# Altium schematic sheet 100-677-01-00 BCB.SchDoc: Battery Control Board (part 1 of 3)
size 889 x 508 mm; DrawnBy: LS/RK; DocumentNumber: 100-677-01-00; Revision: 01-00; SheetNumber: 1; SheetTotal: 1; PageSetup: Record=PageOptions|CenterHorizontal=True|CenterVertical=True|PrintScale=0.21|XCorrection=1.00|YCorrection=1.00|PrintKind=0|BorderSize=5000000|LeftOffset=0|BottomOffset=0|Orientation=2|PaperLength=1000|PaperWidth=1000|Scale=100|PaperSource=7|PrintQuality=-4|MediaType=1|DitherType=10|PaperKind=11x17|PrintScaleMode=1
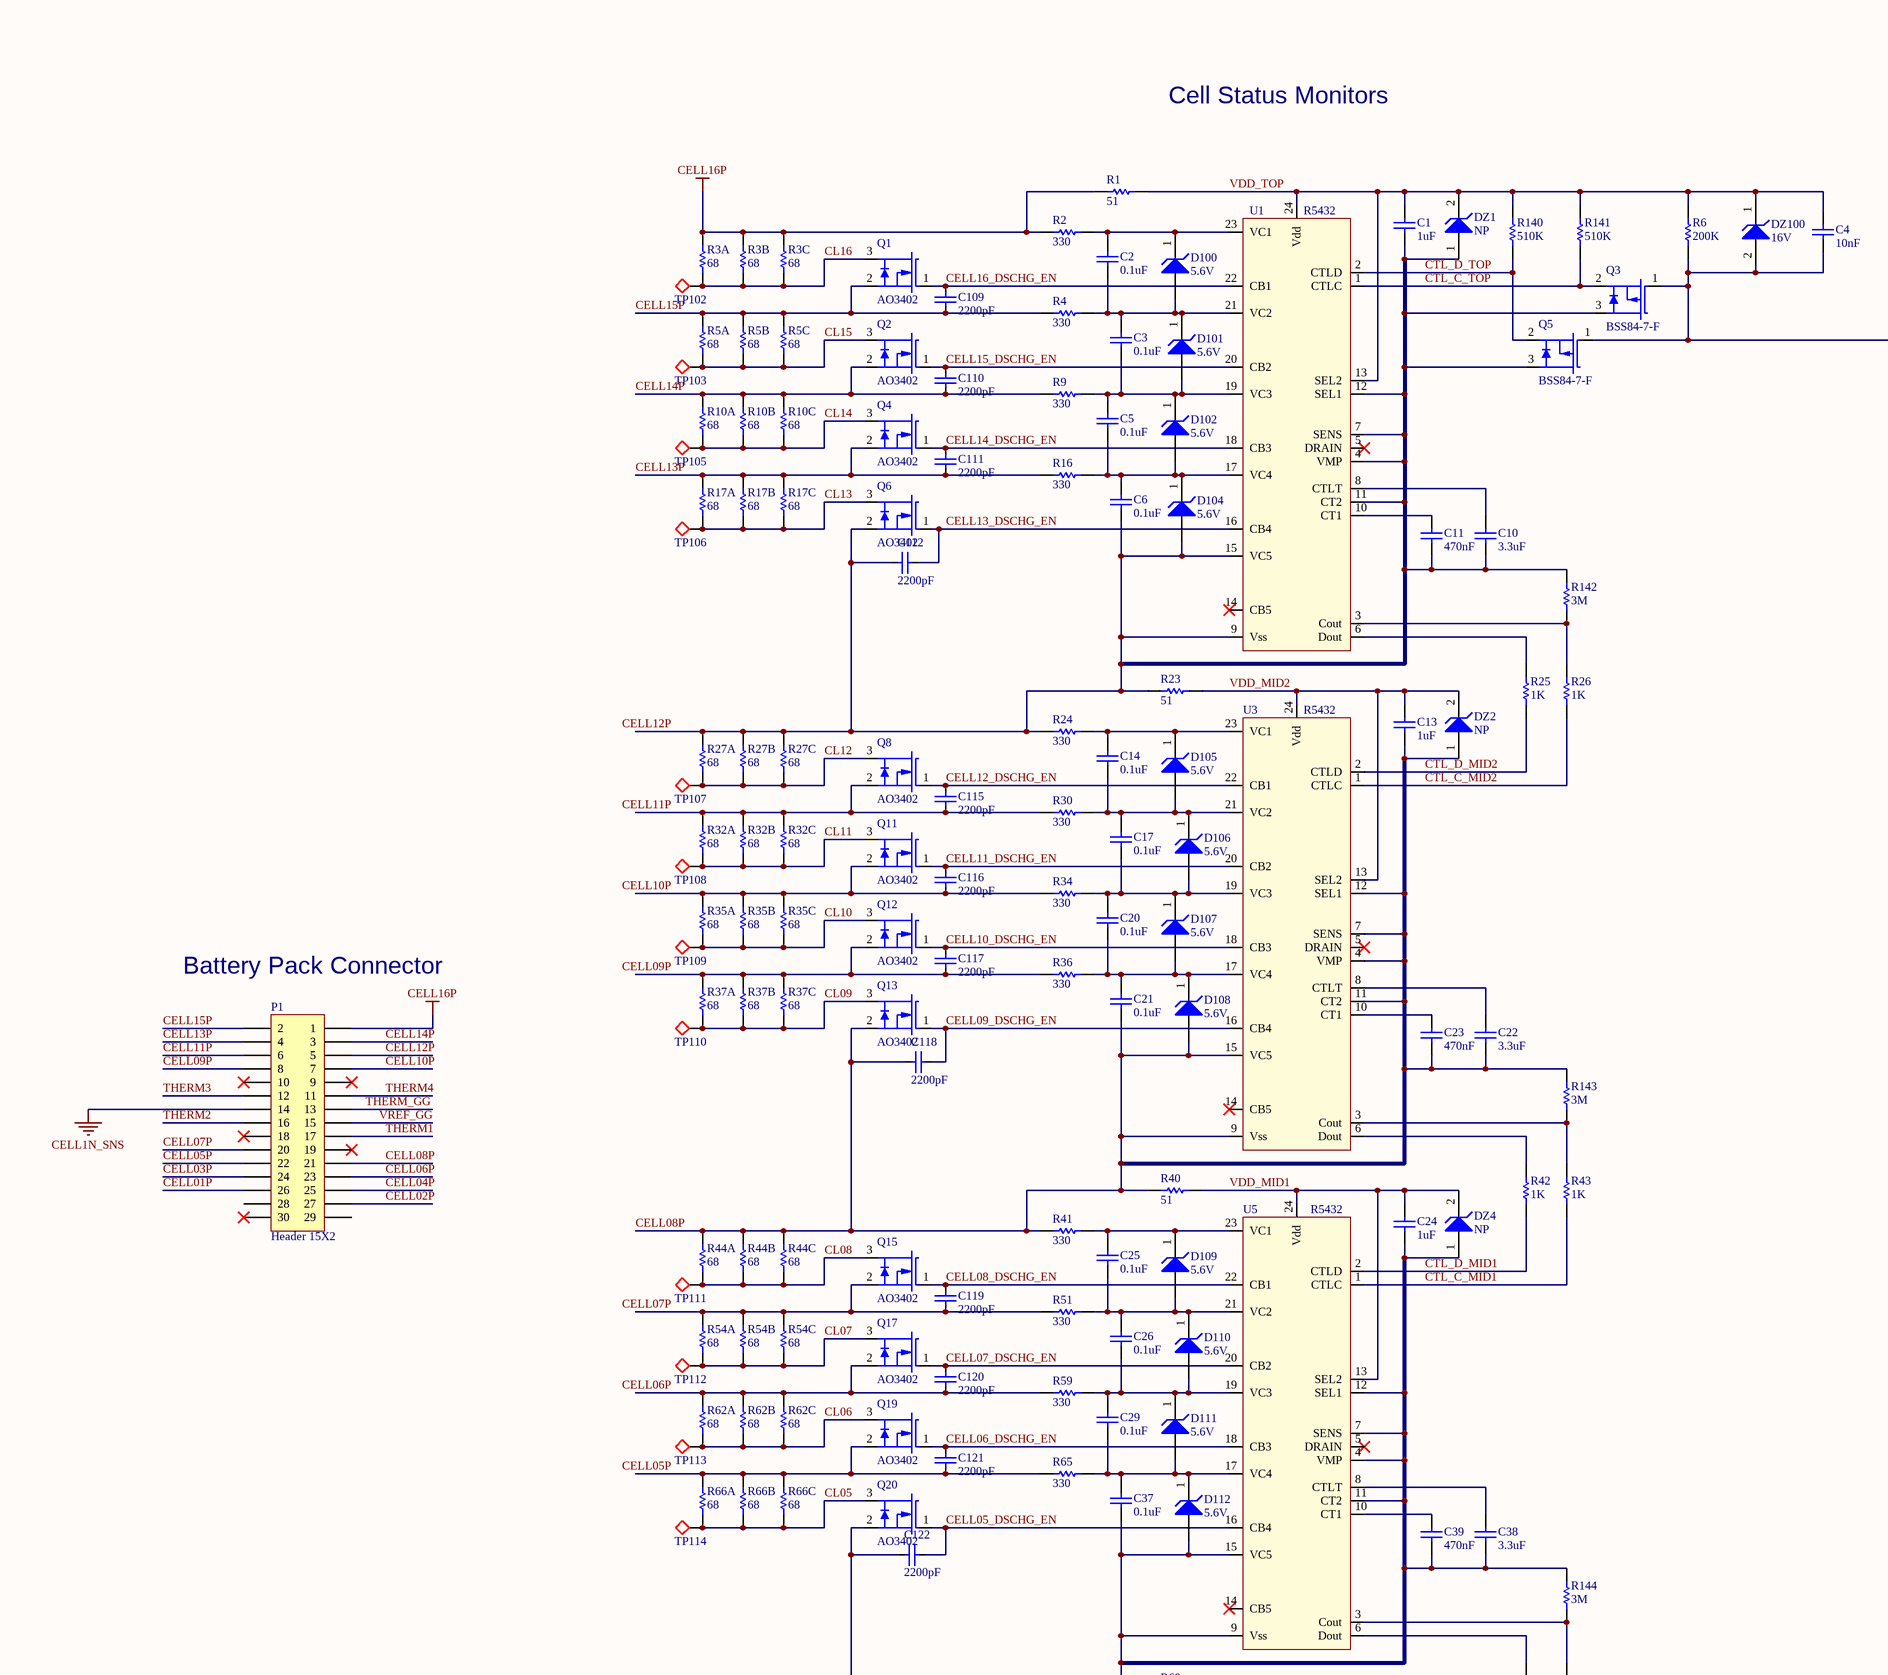
[diagram p0: 100-677-01-00 BCB.SchDoc, top left]
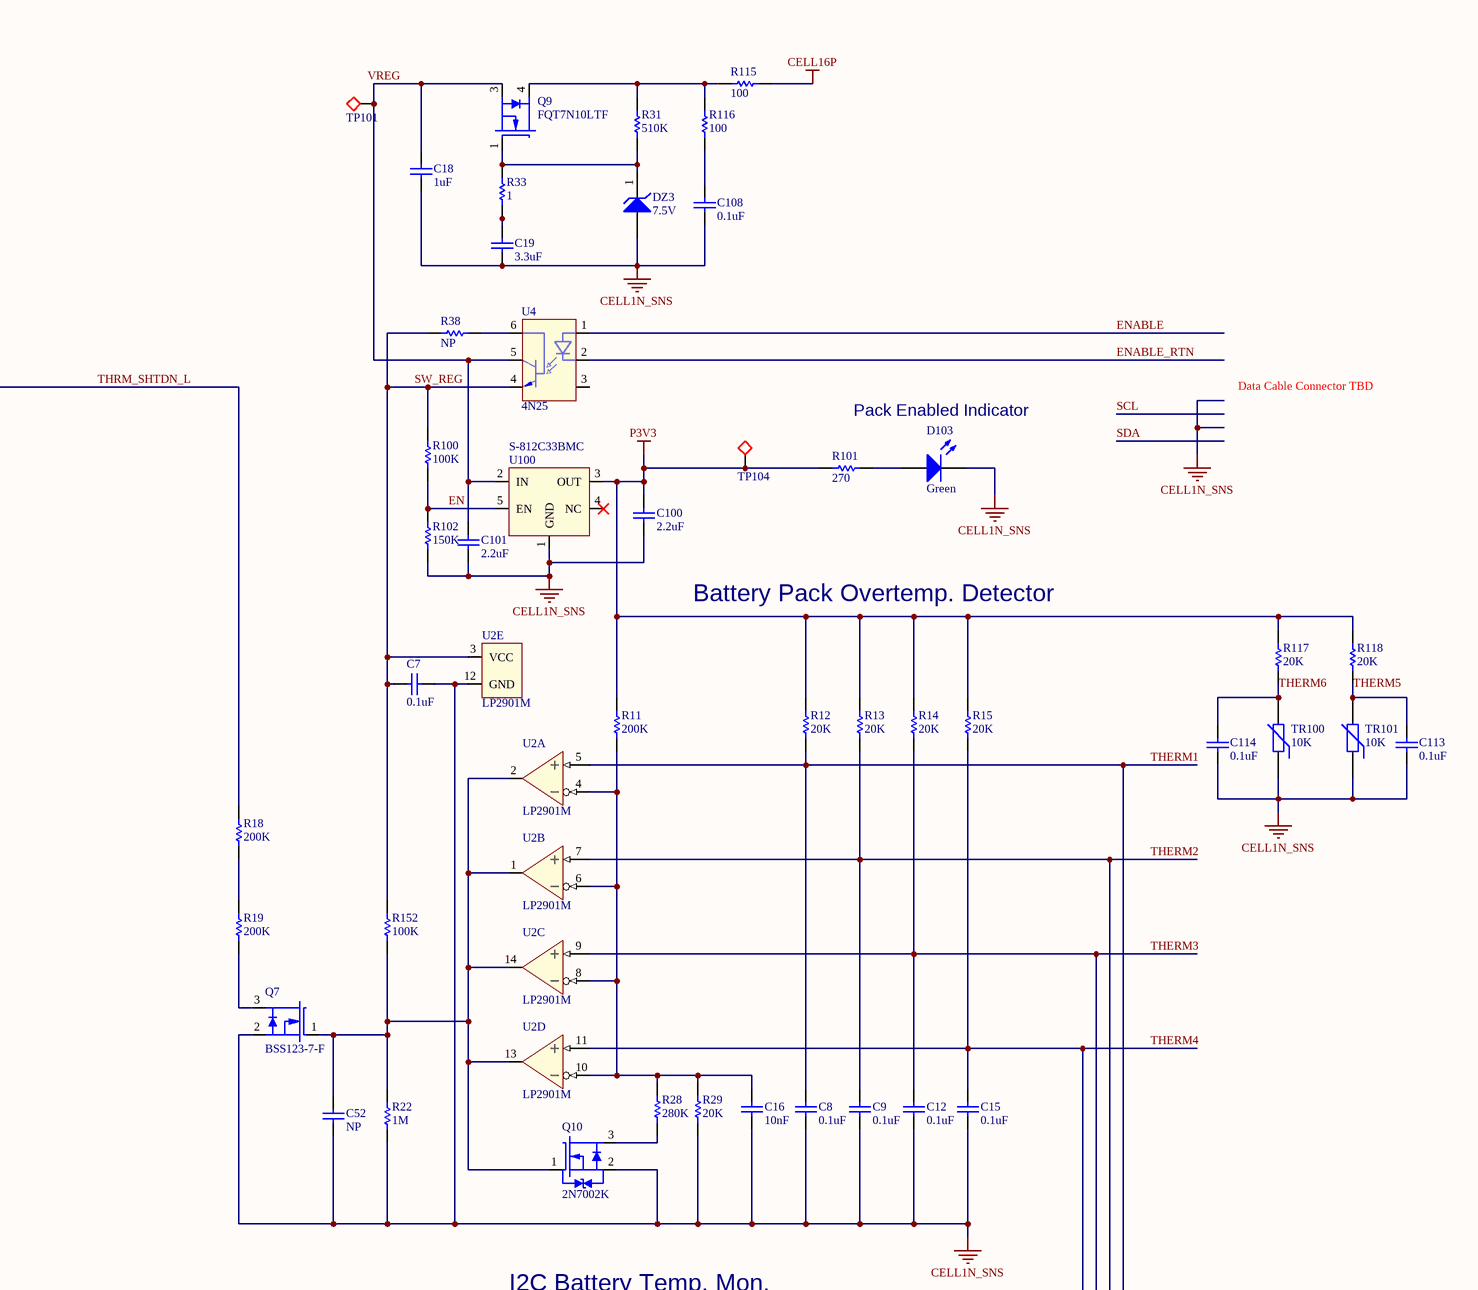
[diagram p1: 100-677-01-00 BCB.SchDoc, top middle]
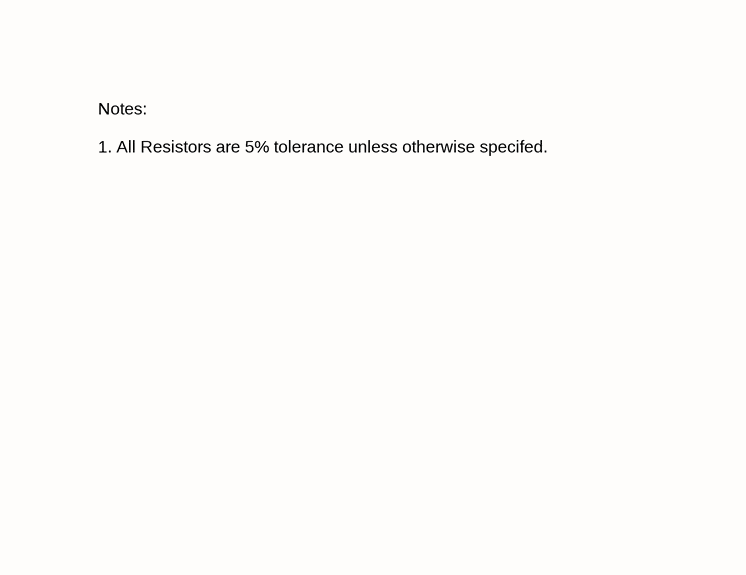
[diagram p2: 100-677-01-00 BCB.SchDoc, top right]
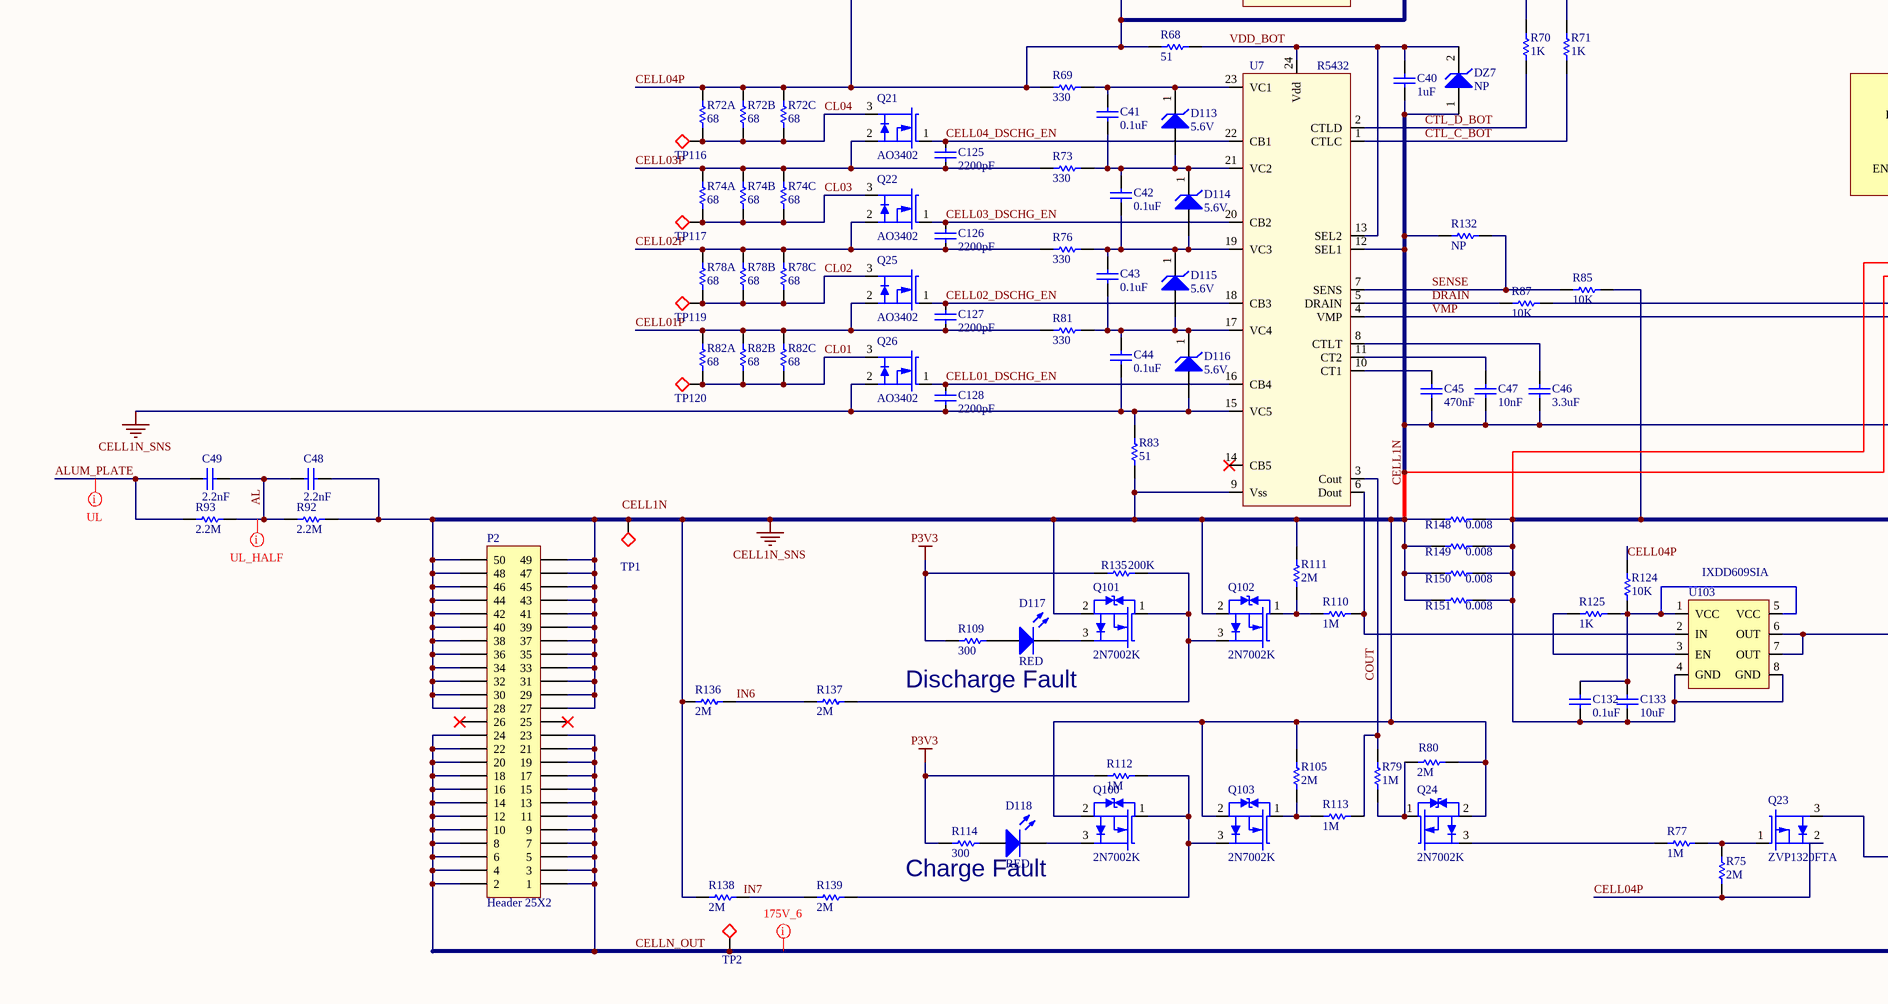
[diagram p3: 100-677-01-00 BCB.SchDoc, bottom left]
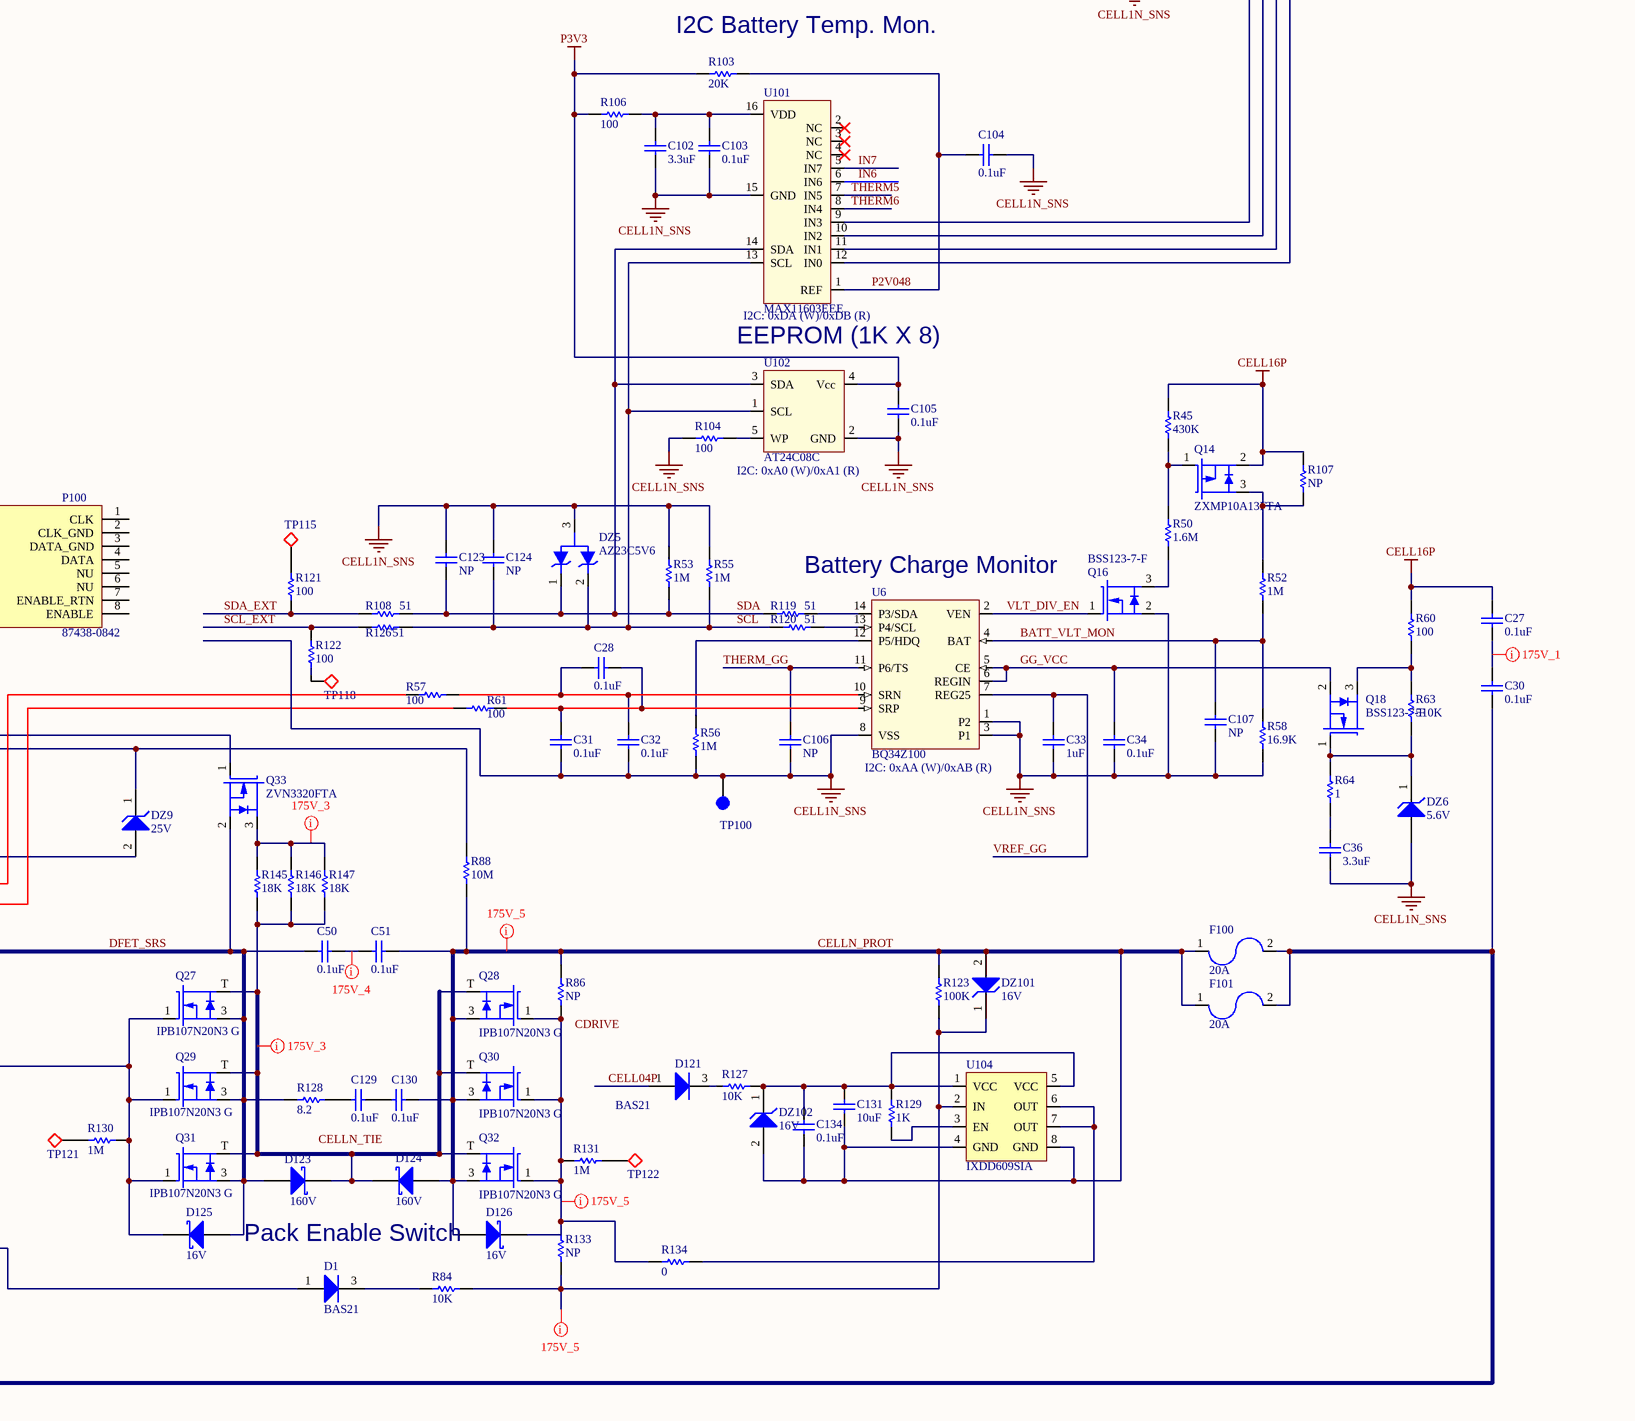
[diagram p4: 100-677-01-00 BCB.SchDoc, bottom middle]
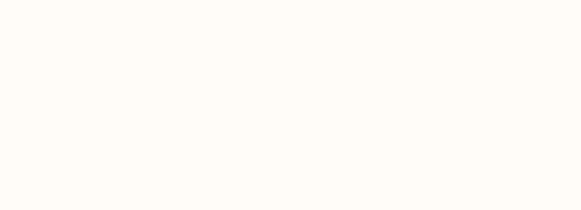
[diagram p5: 100-677-01-00 BCB.SchDoc, bottom right]

## Parts
C1  1uF  [6-0805_N]
C2  0.1uF  [1608[0603]]
C3  0.1uF  [1608[0603]]
C4  10nF  [1608[0603]]
C5  0.1uF  [1608[0603]]
C6  0.1uF  [1608[0603]]
C7  0.1uF  [1608[0603]]
C8  0.1uF  [1608[0603]]
C9  0.1uF  [1608[0603]]
C10  3.3uF  [6-0805_M]
C11  470nF  [1608[0603]]
C12  0.1uF  [1608[0603]]
C13  1uF  [6-0805_N]
C14  0.1uF  [1608[0603]]
C15  0.1uF  [1608[0603]]
C16  10nF  [1608[0603]]
C17  0.1uF  [1608[0603]]
C18  1uF  [1608[0603]]
C19  3.3uF  [6-0805_M]
C20  0.1uF  [1608[0603]]
C21  0.1uF  [1608[0603]]
C22  3.3uF  [6-0805_M]
C23  470nF  [1608[0603]]
C24  1uF  [6-0805_N]
C25  0.1uF  [1608[0603]]
C26  0.1uF  [1608[0603]]
C27  0.1uF  [C1206]
C28  0.1uF  [1608[0603]]
C29  0.1uF  [1608[0603]]
C30  0.1uF  [C1206]
C31  0.1uF  [1608[0603]]
C32  0.1uF  [1608[0603]]
C33  1uF  [6-0805_N]
C34  0.1uF  [1608[0603]]
C36  3.3uF  [6-0805_M]
C37  0.1uF  [1608[0603]]
C38  3.3uF  [6-0805_M]
C39  470nF  [1608[0603]]
C40  1uF  [6-0805_N]
C41  0.1uF  [1608[0603]]
C42  0.1uF  [1608[0603]]
C43  0.1uF  [1608[0603]]
C44  0.1uF  [1608[0603]]
C45  470nF  [1608[0603]]
C46  3.3uF  [6-0805_M]
C47  10nF  [1608[0603]]
C48  2.2nF  [1812]
C49  2.2nF  [1812]
C50  0.1uF  [C1206]
C51  0.1uF  [C1206]
C52  NP  [1608[0603]]
C100  2.2uF  [6-0805_M]
C101  2.2uF  [6-0805_M]
C102  3.3uF  [6-0805_M]
C103  0.1uF  [1608[0603]]
C104  0.1uF  [1608[0603]]
C105  0.1uF  [1608[0603]]
C106  NP  [1608[0603]]
C107  NP  [1608[0603]]
C108  0.1uF  [1608[0603]]
C109  2200pF  [1608[0603]]
C110  2200pF  [1608[0603]]
C111  2200pF  [1608[0603]]
C112  2200pF  [1608[0603]]
C113  0.1uF  [1608[0603]]
C114  0.1uF  [1608[0603]]
C115  2200pF  [1608[0603]]
C116  2200pF  [1608[0603]]
C117  2200pF  [1608[0603]]
C118  2200pF  [1608[0603]]
C119  2200pF  [1608[0603]]
C120  2200pF  [1608[0603]]
C121  2200pF  [1608[0603]]
C122  2200pF  [1608[0603]]
C123  NP  [1608[0603]]
C124  NP  [1608[0603]]
C125  2200pF  [1608[0603]]
C126  2200pF  [1608[0603]]
C127  2200pF  [1608[0603]]
C128  2200pF  [1608[0603]]
C129  0.1uF  [C1206]
C130  0.1uF  [C1206]
C131  10uF  [C1206]
C132  0.1uF  [1608[0603]]
C133  10uF  [C1206]
C134  0.1uF  [1608[0603]]
D1  BAS21  [SOT23_N]
D100  5.6V  [BZT52H (SOD123F)]
D101  5.6V  [BZT52H (SOD123F)]
D102  5.6V  [BZT52H (SOD123F)]
D103  Green  [LED SM REVERSE-GRN]
D104  5.6V  [BZT52H (SOD123F)]
D105  5.6V  [BZT52H (SOD123F)]
D106  5.6V  [BZT52H (SOD123F)]
D107  5.6V  [BZT52H (SOD123F)]
D108  5.6V  [BZT52H (SOD123F)]
D109  5.6V  [BZT52H (SOD123F)]
D110  5.6V  [BZT52H (SOD123F)]
D111  5.6V  [BZT52H (SOD123F)]
D112  5.6V  [BZT52H (SOD123F)]
D113  5.6V  [BZT52H (SOD123F)]
D114  5.6V  [BZT52H (SOD123F)]
D115  5.6V  [BZT52H (SOD123F)]
D116  5.6V  [BZT52H (SOD123F)]
D117  RED  [LED SM REVERSE-RED]
D118  RED  [LED SM REVERSE-RED]
D121  BAS21  [SOT23_N]
D123  160V  [SMB]
D124  160V  [SMB]
D125  16V  [SMB]
D126  16V  [SMB]
DZ1  NP  [BZT52H (SOD123F)]
DZ2  NP  [BZT52H (SOD123F)]
DZ3  7.5V  [BZT52H (SOD123F)]
DZ4  NP  [BZT52H (SOD123F)]
DZ5  AZ23C5V6  [AZ23C5V6 SOT23-3]
DZ6  5.6V  [BZT52H (SOD123F)]
DZ7  NP  [BZT52H (SOD123F)]
DZ9  25V  [MMS52xxxT1G (SOD-123)]
DZ100  16V  [MMS52xxxT1G (SOD-123)]
DZ101  16V  [MMS52xxxT1G (SOD-123)]
DZ102  16V  [MMS52xxxT1G (SOD-123)]
F100  20A  [FUSE 3AB W/PIGTAIL-SURFACE MOUNT 90DEG]
F101  20A  [FUSE 3AB W/PIGTAIL-SURFACE MOUNT 90DEG]
P1  Header 15X2  [HDR 2X15 0.1" CTRS TH SHROUDED W/PCB ALG PIN]
P2  Header 25X2  [HDR 2X25 0.1" CTRS TH SHROUDED W/PCB LOC PIN]
P100  87438-0842  [HDR1X8]
Q1  AO3402  [NDS331N (SOT23-3)]
Q2  AO3402  [NDS331N (SOT23-3)]
Q3  BSS84-7-F  [ZVP1320F (SOT23-3)]
Q4  AO3402  [NDS331N (SOT23-3)]
Q5  BSS84-7-F  [ZVP1320F (SOT23-3)]
Q6  AO3402  [NDS331N (SOT23-3)]
Q7  BSS123-7-F  [BSS123-7-F (SOT23-3)]
Q8  AO3402  [NDS331N (SOT23-3)]
Q9  FQT7N10LTF  [FT7N10L (SOT230P700X180-4N)]
Q10  2N7002K  [2N7002K (SOT23-3)]
Q11  AO3402  [NDS331N (SOT23-3)]
Q12  AO3402  [NDS331N (SOT23-3)]
Q13  AO3402  [NDS331N (SOT23-3)]
Q14  ZXMP10A13FTA  [BSS84 (SOT23-3)]
Q15  AO3402  [NDS331N (SOT23-3)]
Q16  BSS123-7-F  [BSS123-7-F (SOT23-3)]
Q17  AO3402  [NDS331N (SOT23-3)]
Q18  BSS123-7-F  [BSS123-7-F (SOT23-3)]
Q19  AO3402  [NDS331N (SOT23-3)]
Q20  AO3402  [NDS331N (SOT23-3)]
Q21  AO3402  [NDS331N (SOT23-3)]
Q22  AO3402  [NDS331N (SOT23-3)]
Q23  ZVP1320FTA  [ZVP1320F (SOT23-3)]
Q24  2N7002K  [2N7002K (SOT23-3)]
Q25  AO3402  [NDS331N (SOT23-3)]
Q26  AO3402  [NDS331N (SOT23-3)]
Q27  IPB107N20N3 G  [IPB107N20N3 G (PG-TO263-3)]
Q28  IPB107N20N3 G  [IPB107N20N3 G (PG-TO263-3)]
Q29  IPB107N20N3 G  [IPB107N20N3 G (PG-TO263-3)]
Q30  IPB107N20N3 G  [IPB107N20N3 G (PG-TO263-3)]
Q31  IPB107N20N3 G  [IPB107N20N3 G (PG-TO263-3)]
Q32  IPB107N20N3 G  [IPB107N20N3 G (PG-TO263-3)]
Q33  ZVN3320FTA  [BSS123-7-F (SOT23-3)]
Q100  2N7002K  [2N7002K (SOT23-3)]
Q101  2N7002K  [2N7002K (SOT23-3)]
Q102  2N7002K  [2N7002K (SOT23-3)]
Q103  2N7002K  [2N7002K (SOT23-3)]
R1  51  [1608[0603]]
R2  330  [1608[0603]]
R3A  68  [RES SM2512 W/ HEATSINK]
R3B  68  [RES SM2512 W/ HEATSINK]
R3C  68  [RES SM2512 W/ HEATSINK]
R4  330  [1608[0603]]
R5A  68  [RES SM2512 W/ HEATSINK]
R5B  68  [RES SM2512 W/ HEATSINK]
R5C  68  [RES SM2512 W/ HEATSINK]
R6  200K  [1608[0603]]
R9  330  [1608[0603]]
R10A  68  [RES SM2512 W/ HEATSINK]
R10B  68  [RES SM2512 W/ HEATSINK]
R10C  68  [RES SM2512 W/ HEATSINK]
R11  200K  [1608[0603]]
R12  20K  [1608[0603]]
R13  20K  [1608[0603]]
R14  20K  [1608[0603]]
R15  20K  [1608[0603]]
R16  330  [1608[0603]]
R17A  68  [RES SM2512 W/ HEATSINK]
R17B  68  [RES SM2512 W/ HEATSINK]
R17C  68  [RES SM2512 W/ HEATSINK]
R18  200K  [1608[0603]]
R19  200K  [1608[0603]]
R22  1M  [1608[0603]]
R23  51  [1608[0603]]
R24  330  [1608[0603]]
R25  1K  [1608[0603]]
R26  1K  [1608[0603]]
R27A  68  [RES SM2512 W/ HEATSINK]
R27B  68  [RES SM2512 W/ HEATSINK]
R27C  68  [RES SM2512 W/ HEATSINK]
R28  280K  [1608[0603]]
R29  20K  [1608[0603]]
R30  330  [1608[0603]]
R31  510K  [6-0805_N]
R32A  68  [RES SM2512 W/ HEATSINK]
R32B  68  [RES SM2512 W/ HEATSINK]
R32C  68  [RES SM2512 W/ HEATSINK]
R33  1  [1608[0603]]
R34  330  [1608[0603]]
R35A  68  [RES SM2512 W/ HEATSINK]
R35B  68  [RES SM2512 W/ HEATSINK]
R35C  68  [RES SM2512 W/ HEATSINK]
R36  330  [1608[0603]]
R37A  68  [RES SM2512 W/ HEATSINK]
R37B  68  [RES SM2512 W/ HEATSINK]
R37C  68  [RES SM2512 W/ HEATSINK]
R38  NP  [1608[0603]]
R40  51  [1608[0603]]
R41  330  [1608[0603]]
R42  1K  [1608[0603]]
R43  1K  [1608[0603]]
R44A  68  [RES SM2512 W/ HEATSINK]
R44B  68  [RES SM2512 W/ HEATSINK]
R44C  68  [RES SM2512 W/ HEATSINK]
R45  430K  [1608[0603]]
R50  1.6M  [6-0805_N]
R51  330  [1608[0603]]
R52  1M  [6-0805_N]
R53  1M  [1608[0603]]
R54A  68  [RES SM2512 W/ HEATSINK]
R54B  68  [RES SM2512 W/ HEATSINK]
R54C  68  [RES SM2512 W/ HEATSINK]
R55  1M  [1608[0603]]
R56  1M  [1608[0603]]
R57  100  [1608[0603]]
R58  16.9K  [1608[0603]]
R59  330  [1608[0603]]
R60  100  [6-0805_N]
R61  100  [1608[0603]]
R62A  68  [RES SM2512 W/ HEATSINK]
R62B  68  [RES SM2512 W/ HEATSINK]
R62C  68  [RES SM2512 W/ HEATSINK]
R63  510K  [6-0805_N]
R64  1  [1608[0603]]
R65  330  [1608[0603]]
R66A  68  [RES SM2512 W/ HEATSINK]
R66B  68  [RES SM2512 W/ HEATSINK]
R66C  68  [RES SM2512 W/ HEATSINK]
R68  51  [1608[0603]]
R69  330  [1608[0603]]
R70  1K  [1608[0603]]
R71  1K  [1608[0603]]
R72A  68  [RES SM2512 W/ HEATSINK]
R72B  68  [RES SM2512 W/ HEATSINK]
R72C  68  [RES SM2512 W/ HEATSINK]
R73  330  [1608[0603]]
R74A  68  [RES SM2512 W/ HEATSINK]
R74B  68  [RES SM2512 W/ HEATSINK]
R74C  68  [RES SM2512 W/ HEATSINK]
R75  2M  [1608[0603]]
R76  330  [1608[0603]]
R77  1M  [1608[0603]]
R78A  68  [RES SM2512 W/ HEATSINK]
R78B  68  [RES SM2512 W/ HEATSINK]
R78C  68  [RES SM2512 W/ HEATSINK]
R79  1M  [1608[0603]]
R80  2M  [1608[0603]]
R81  330  [1608[0603]]
R82A  68  [RES SM2512 W/ HEATSINK]
R82B  68  [RES SM2512 W/ HEATSINK]
R82C  68  [RES SM2512 W/ HEATSINK]
R83  51  [C1206]
R84  10K  [6-0805_N]
R85  10K  [1608[0603]]
R86  NP  [1608[0603]]
R87  10K  [1608[0603]]
R88  10M  [C1206]
R92  2.2M  [C1206]
R93  2.2M  [C1206]
R100  100K  [1608[0603]]
R101  270  [1608[0603]]
R102  150K  [1608[0603]]
R103  20K  [1608[0603]]
R104  100  [1608[0603]]
R105  2M  [1608[0603]]
R106  100  [1608[0603]]
R107  NP  [1608[0603]]
R108  51  [1608[0603]]
R109  300  [1608[0603]]
R110  1M  [1608[0603]]
R111  2M  [1608[0603]]
R112  1M  [1608[0603]]
R113  1M  [1608[0603]]
R114  300  [1608[0603]]
R115  100  [6-0805_N]
R116  100  [6-0805_N]
R117  20K  [1608[0603]]
R118  20K  [1608[0603]]
R119  51  [1608[0603]]
R120  51  [1608[0603]]
R121  100  [1608[0603]]
R122  100  [1608[0603]]
R123  100K  [1608[0603]]
R124  10K  [1608[0603]]
R125  1K  [1608[0603]]
R126  51  [1608[0603]]
R127  10K  [1608[0603]]
R128  8.2  [C1206]
R129  1K  [1608[0603]]
R130  1M  [1608[0603]]
R131  1M  [1608[0603]]
R132  NP  [1608[0603]]
R133  NP  [6-0805_N]
R134  0  [6-0805_N]
R135  200K  [1608[0603]]
R136  2M  [1608[0603]]
R137  2M  [1608[0603]]
R138  2M  [1608[0603]]
R139  2M  [1608[0603]]
R140  510K  [1608[0603]]
R141  510K  [1608[0603]]
R142  3M  [1608[0603]]
R143  3M  [1608[0603]]
R144  3M  [1608[0603]]
R145  18K  [RES SM2512 W/ HEATSINK]
R146  18K  [RES SM2512 W/ HEATSINK]
R147  18K  [RES SM2512 W/ HEATSINK]
R148  0.008  [C2512]
R149  0.008  [C2512]
R150  0.008  [C2512]
R151  0.008  [C2512]
R152  100K  [1608[0603]]
TP1  Test Point VIA  [TEST POINT 60/37 .025 VIA]  (value not drawn)
TP2  Test Point VIA  [TEST POINT 60/37 .025 VIA]  (value not drawn)
TP100  Test Point SMT  [TEST_POINT_SM_4.7MMX3.4MM]  (value not drawn)
TP101  Test Point VIA  [TEST POINT 60/37 .025 VIA]  (value not drawn)
TP102  Test Point VIA  [TEST POINT 60/37 .025 VIA]  (value not drawn)
TP103  Test Point VIA  [TEST POINT 60/37 .025 VIA]  (value not drawn)
TP104  Test Point VIA  [TEST POINT 60/37 .025 VIA]  (value not drawn)
TP105  Test Point VIA  [TEST POINT 60/37 .025 VIA]  (value not drawn)
TP106  Test Point VIA  [TEST POINT 60/37 .025 VIA]  (value not drawn)
TP107  Test Point VIA  [TEST POINT 60/37 .025 VIA]  (value not drawn)
TP108  Test Point VIA  [TEST POINT 60/37 .025 VIA]  (value not drawn)
TP109  Test Point VIA  [TEST POINT 60/37 .025 VIA]  (value not drawn)
TP110  Test Point VIA  [TEST POINT 60/37 .025 VIA]  (value not drawn)
TP111  Test Point VIA  [TEST POINT 60/37 .025 VIA]  (value not drawn)
TP112  Test Point VIA  [TEST POINT 60/37 .025 VIA]  (value not drawn)
TP113  Test Point VIA  [TEST POINT 60/37 .025 VIA]  (value not drawn)
TP114  Test Point VIA  [TEST POINT 60/37 .025 VIA]  (value not drawn)
TP115  Test Point VIA  [TEST POINT 60/37 .025 VIA]  (value not drawn)
TP116  Test Point VIA  [TEST POINT 60/37 .025 VIA]  (value not drawn)
TP117  Test Point VIA  [TEST POINT 60/37 .025 VIA]  (value not drawn)
TP118  Test Point VIA  [TEST POINT 60/37 .025 VIA]  (value not drawn)
TP119  Test Point VIA  [TEST POINT 60/37 .025 VIA]  (value not drawn)
TP120  Test Point VIA  [TEST POINT 60/37 .025 VIA]  (value not drawn)
TP121  Test Point VIA  [TEST POINT 60/37 .025 VIA]  (value not drawn)
TP122  Test Point VIA  [TEST POINT 60/37 .025 VIA]  (value not drawn)
TR100  10K  [RES SM2512 W/ HEATSINK]
TR101  10K  [RES SM2512 W/ HEATSINK]
U1  R5432  [TSSOP-24 (TSSOP065P600-24N]
U2  LP2901M  [LM2901M (SOP127P600-14N)]  (parts A,B,C,D,E of 5)
U3  R5432  [TSSOP-24 (TSSOP065P600-24N]
U4  4N25  [4N25SM (SOIC254P1020X460-6N)]
U5  R5432  [TSSOP-24 (TSSOP065P600-24N]
U6  BQ34Z100  [BQ34Z100 (TSSOP-14)]
U7  R5432  [TSSOP-24 (TSSOP065P600-24N]
U100  S-812C33BMC  [S-812C (SOT23-5)]
U101  MAX11603EEE  [MAX11603EEE (QSOP0635P600-16N)]
U102  AT24C08C  [AT24C0xC-STUM-T (SOT23-5)]
U103  IXDD609SIA  [SOIC127P600-8AM]
U104  IXDD609SIA  [SOIC127P600-8AM]

## Nets
CELL1N: C7.1 C8.1 C9.1 C12.1 C15.1 C16.2 C18.1 C19.1 C31.2 C32.1 C33.1 C34.1 C36.1 C40.2 C44.1 C45.2 C46.2 C47.2 C48.1 C52.1 C100.2 C101.2 C102.2 C103.1 C104.1 C105.1 C106.1 C107.1 C108.1 C113.1 C114.1 C123.1 C124.1 C128.1 D103.2(K) D116.2(A) DZ3.2(A) DZ5.3(D) DZ6.2(A) DZ7.1(A) DZ9.2(A) P1.14 P2.27 P2.28 P2.29 P2.30 P2.31 P2.32 P2.33 P2.34 P2.35 P2.36 P2.37 P2.38 P2.39 P2.40 P2.41 P2.42 P2.43 P2.44 P2.45 P2.46 P2.47 P2.48 P2.49 P2.50 Q7.2(S) Q10.2(S) Q16.2(S) Q24.2(S) Q26.2(S) Q100.2(S) Q101.2(S) Q102.2(S) Q103.2(S) R22.1 R29.1 R53.2 R55.2 R56.1 R58.1 R61.1 R80.2 R83.1 R83.2 R92.1 R102.1 R104.1 R105.2 R111.2 R132.1 R136.1 R138.1 R148.1 R149.1 R150.1 R151.1 TP1.1 TP100.1 TR100.1 TR101.1 U2.12(GND) U6.1(P2) U6.3(P1) U6.8(VSS) U7.9(Vss) U7.12(SEL1) U7.15(VC5) U100.1(GND) U101.15(GND) U102.2(GND)  [also labelled CELL1N_SNS]
CELL16P: C27.2 P1.1 Q14.2(S) R1.1 R2.1 R3A.2 R3B.2 R3C.2 R45.2 R60.2 R107.2 R115.2
P3V3: C100.1 C105.2 R11.2 R12.2 R13.2 R14.2 R15.2 R101.1 R103.1 R106.1 R109.2 R112.2 R114.2 R117.2 R118.2 R135.1 TP104.1 U100.3(OUT) U102.4(Vcc)
AL: C48.2 C49.1 R92.2 R93.1
ALUM_PLATE: C49.2 R93.2
BATT_VLT_MON: C107.2 R52.1 R58.2 U6.4(BAT)
CELL01_DSCHG_EN: C128.2 Q26.1(G) U7.16(CB4)
CELL01P: C127.1 P1.26 Q25.2(S) R81.1 R82A.2 R82B.2 R82C.2
CELL02_DSCHG_EN: C127.2 Q25.1(G) U7.18(CB3)
CELL02P: C126.1 P1.27 Q22.2(S) R76.1 R78A.2 R78B.2 R78C.2
CELL03_DSCHG_EN: C126.2 Q22.1(G) U7.20(CB2)
CELL03P: C125.1 P1.24 Q21.2(S) R73.1 R74A.2 R74B.2 R74C.2
CELL04_DSCHG_EN: C125.2 Q21.1(G) U7.22(CB1)
CELL04P: C24.2 C37.1 C38.2 C39.2 C122.2 D112.2(A) D121.1(A) DZ4.1(A) P1.25 Q20.2(S) Q23.2(S) R68.1 R69.1 R72A.2 R72B.2 R72C.2 R75.2 R124.2 R144.2 U5.4(VMP) U5.7(SENS) U5.9(Vss) U5.11(CT2) U5.12(SEL1) U5.15(VC5)
CELL05_DSCHG_EN: C122.1 Q20.1(G) U5.16(CB4)
CELL05P: P1.22
CELL06_DSCHG_EN: C121.2 Q19.1(G) U5.18(CB3)
CELL06P: P1.23
CELL07_DSCHG_EN: C120.2 Q17.1(G) U5.20(CB2)
CELL07P: P1.20
CELL08_DSCHG_EN: C119.2 Q15.1(G) U5.22(CB1)
CELL08P: C13.2 C21.1 C22.2 C23.2 C118.1 D108.2(A) DZ2.1(A) P1.21 Q13.2(S) R40.1 R41.1 R44A.2 R44B.2 R44C.2 R143.2 U3.4(VMP) U3.7(SENS) U3.9(Vss) U3.11(CT2) U3.12(SEL1) U3.15(VC5)
CELL09_DSCHG_EN: C118.2 Q13.1(G) U3.16(CB4)
CELL09P: P1.8
CELL10_DSCHG_EN: C117.1 Q12.1(G) U3.18(CB3)
CELL10P: P1.7
CELL11_DSCHG_EN: C116.1 Q11.1(G) U3.20(CB2)
CELL11P: P1.6
CELL12_DSCHG_EN: C115.1 Q8.1(G) U3.22(CB1)
CELL12P: P1.5
CELL13_DSCHG_EN: C112.1 Q6.1(G) U1.16(CB4)
CELL13P: C111.1 P1.4 Q4.2(S) R16.1 R17A.2 R17B.2 R17C.2
CELL14_DSCHG_EN: C111.2 Q4.1(G) U1.18(CB3)
CELL14P: C110.1 P1.3 Q2.2(S) R9.1 R10A.2 R10B.2 R10C.2
CELL15_DSCHG_EN: C110.2 Q2.1(G) U1.20(CB2)
CELL15P: C109.1 P1.2 Q1.2(S) R4.1 R5A.2 R5B.2 R5C.2
CELL16_DSCHG_EN: C109.2 Q1.1(G) U1.22(CB1)
CELLN_OUT: C30.1 F100.2(B) F101.2(B) P2.1 P2.2 P2.3 P2.4 P2.5 P2.6 P2.7 P2.8 P2.9 P2.10 P2.11 P2.12 P2.13 P2.14 P2.15 P2.16 P2.17 P2.18 P2.19 P2.20 P2.21 P2.22 P2.23 P2.24 TP2.1
CELLN_PROT: C51.1 C130.1 C131.2 C134.1 D124.1(A) D126.1(A) DZ101.2(A) DZ102.2(A) F100.1(A) F101.1(A) Q28.3(S) Q30.3(S) Q32.3(S) R86.2 R88.1 R123.1 U104.4(GND) U104.8(GND)
CL01: Q26.3(D) R82A.1 R82B.1 R82C.1 TP120.1
CL02: Q25.3(D) R78A.1 R78B.1 R78C.1 TP119.1
CL03: Q22.3(D) R74A.1 R74B.1 R74C.1 TP117.1
CL04: Q21.3(D) R72A.1 R72B.1 R72C.1 TP116.1
CL05: Q20.3(D) R66A.1 R66B.1 R66C.1 TP114.1
CL06: Q19.3(D) R62A.1 R62B.1 R62C.1 TP113.1
CL07: Q17.3(D) R54A.1 R54B.1 R54C.1 TP112.1
CL08: Q15.3(D) R44A.1 R44B.1 R44C.1 TP111.1
CL09: Q13.3(D) R37A.1 R37B.1 R37C.1 TP110.1
CL10: Q12.3(D) R35A.1 R35B.1 R35C.1 TP109.1
CL11: Q11.3(D) R32A.1 R32B.1 R32C.1 TP108.1
CL12: Q8.3(D) R27A.1 R27B.1 R27C.1 TP107.1
CL13: Q6.3(D) R17A.1 R17B.1 R17C.1 TP106.1
CL14: Q4.3(D) R10A.1 R10B.1 R10C.1 TP105.1
CL15: Q2.3(D) R5A.1 R5B.1 R5C.1 TP103.1
CL16: Q1.3(D) R3A.1 R3B.1 R3C.1 TP102.1
COUT: R79.1 R113.2 U7.3(Cout)
CTL_C_BOT: R71.1 U7.1(CTLC)
CTL_C_MID1: R43.1 U5.1(CTLC)
CTL_C_MID2: R26.1 U3.1(CTLC)
CTL_C_TOP: Q3.2(S) R141.1 U1.1(CTLC)
CTL_D_BOT: R70.1 U7.2(CTLD)
CTL_D_MID1: R42.1 U5.2(CTLD)
CTL_D_MID2: R25.1 U3.2(CTLD)
CTL_D_TOP: Q5.2(S) R140.1 U1.2(CTLD)
DFET_SRS: C50.2 C132.2 C133.2 D123.1(A) D125.1(A) Q27.3(S) Q29.3(S) Q31.3(S) Q33.2(S) R57.1 R85.1 R128.1 R148.2 R149.2 R150.2 R151.2 U103.4(GND) U103.8(GND)
DRAIN: R87.2 U7.5(DRAIN)
EN: R100.1 R102.2 U100.5(EN)
ENABLE: U4.1(A)
ENABLE_RTN: U4.2(K)
GG_VCC: C34.2 Q18.2(S) U6.5(CE) U6.6(REGIN)
IN6: R136.2 R137.1 U101.6(IN6)
IN7: U101.5(IN7)
P2V048: C104.2 R103.2 U101.1(REF)
SCL: C124.2 DZ5.2(S) R55.1 R120.1 R126.2 U101.13(SCL) U102.1(SCL)
SCL_EXT: R122.2 R126.1
SDA: C123.2 DZ5.1(G) R53.1 R108.2 R119.1 U101.14(SDA) U102.3(SDA)
SDA_EXT: R108.1 R121.1
SENSE: R85.2 R132.2 U7.7(SENS)
SW_REG: C7.2 R38.2 R100.2 R152.2 U2.3(VCC) U4.4(E)
THERM1: C8.2 P1.17 R12.1 U2.5(IN1+) U101.12(IN0)
THERM2: C9.2 P1.16 R13.1 U2.7(IN2+) U101.11(IN1)
THERM3: C12.2 P1.12 R14.1 U2.9(IN3+) U101.10(IN2)
THERM4: C15.2 P1.11 R15.1 U2.11(IN4+) U101.9(IN3)
THERM5: C113.2 R118.1 TR101.2 U101.7(IN5)
THERM6: C114.2 R117.1 TR100.2 U101.8(IN4)
THERM_GG: C106.2 P1.13 U6.11(P6/TS)
THRM_SHTDN_L: C4.2 DZ100.2(A) Q3.1(G) Q5.1(G) R6.1 R18.2
VDD_BOT: C40.1 DZ7.2(K) R68.2 U7.13(SEL2) U7.24(Vdd)
VDD_MID1: C24.1 DZ4.2(K) R40.2 U5.13(SEL2) U5.24(Vdd)
VDD_MID2: C13.1 DZ2.2(K) R23.2 U3.13(SEL2) U3.24(Vdd)
VDD_TOP: C1.1 C4.1 DZ1.2(K) DZ100.1(K) R1.2 R6.2 R140.2 R141.2 U1.13(SEL2) U1.24(Vdd)
VLT_DIV_EN: Q16.1(G) U6.2(VEN)
VMP: DZ9.1(K) R88.2 U7.4(VMP)
VREF_GG: C33.2 P1.15 U6.7(REG25)
NetC1_2: C1.2 C6.1 C10.2 C11.2 C112.2 D104.2(A) DZ1.1(A) Q3.3(D) Q5.3(D) Q6.2(S) R23.1 R24.1 R27A.2 R27B.2 R27C.2 R142.2 U1.4(VMP) U1.7(SENS) U1.9(Vss) U1.11(CT2) U1.12(SEL1) U1.15(VC5)
NetC2_1: C2.1 C3.2 D100.2(A) D101.1(K) R4.2 U1.21(VC2)
NetC2_2: C2.2 D100.1(K) R2.2 U1.23(VC1)
NetC3_1: C3.1 C5.2 D101.2(A) D102.1(K) R9.2 U1.19(VC3)
NetC5_1: C5.1 C6.2 D102.2(A) D104.1(K) R16.2 U1.17(VC4)
NetC10_1: C10.1 U1.8(CTLT)
NetC11_1: C11.1 U1.10(CT1)
NetC14_1: C14.1 C17.2 D105.2(A) D106.1(K) R30.2 U3.21(VC2)
NetC14_2: C14.2 D105.1(K) R24.2 U3.23(VC1)
NetC16_1: C16.1 R11.1 R28.2 R29.2 U2.4(IN1-) U2.6(IN2-) U2.8(IN3-) U2.10(IN4-)
NetC17_1: C17.1 C20.2 D106.2(A) D107.1(K) R34.2 U3.19(VC3)
NetC18_2: C18.2 C101.1 Q9.3(S) TP101.1 U4.5(C) U100.2(IN)
NetC19_2: C19.2 R33.1
NetC20_1: C20.1 C21.2 D107.2(A) D108.1(K) R36.2 U3.17(VC4)
NetC22_1: C22.1 U3.8(CTLT)
NetC23_1: C23.1 U3.10(CT1)
NetC25_1: C25.1 C26.2 D109.2(A) D110.1(K) R51.2 U5.21(VC2)
NetC25_2: C25.2 D109.1(K) R41.2 U5.23(VC1)
NetC26_1: C26.1 C29.2 D110.2(A) D111.1(K) R59.2 U5.19(VC3)
NetC27_1: C27.1 C30.2
NetC28_1: C28.1 C31.1 R61.2 U6.9(SRP)
NetC28_2: C28.2 C32.2 R57.2 U6.10(SRN)
NetC29_1: C29.1 C37.2 D111.2(A) D112.1(K) R65.2 U5.17(VC4)
NetC36_2: C36.2 R64.1
NetC38_1: C38.1 U5.8(CTLT)
NetC39_1: C39.1 U5.10(CT1)
NetC41_1: C41.1 C42.2 D113.2(A) D114.1(K) R73.2 U7.21(VC2)
NetC41_2: C41.2 D113.1(K) R69.2 U7.23(VC1)
NetC42_1: C42.1 C43.2 D114.2(A) D115.1(K) R76.2 U7.19(VC3)
NetC43_1: C43.1 C44.2 D115.2(A) D116.1(K) R81.2 U7.17(VC4)
NetC45_1: C45.1 U7.10(CT1)
NetC46_1: C46.1 U7.8(CTLT)
NetC47_1: C47.1 U7.11(CT2)
NetC50_1: C50.1 C51.2
NetC52_2: C52.2 Q7.1(G) Q10.1(G) R22.2 R152.1 U2.1(OUT2) U2.2(OUT1) U2.13(OUT4) U2.14(OUT3)
NetC102_1: C102.1 C103.2 R106.2 U101.16(VDD)
NetC108_2: C108.2 R116.1
NetC115_2: C115.2 Q8.2(S) R30.1 R32A.2 R32B.2 R32C.2
NetC116_2: C116.2 Q11.2(S) R34.1 R35A.2 R35B.2 R35C.2
NetC117_2: C117.2 Q12.2(S) R36.1 R37A.2 R37B.2 R37C.2
NetC119_1: C119.1 Q15.2(S) R51.1 R54A.2 R54B.2 R54C.2
NetC120_1: C120.1 Q17.2(S) R59.1 R62A.2 R62B.2 R62C.2
NetC121_1: C121.1 Q19.2(S) R65.1 R66A.2 R66B.2 R66C.2
NetC129_1: C129.1 C130.2
NetC129_2: C129.2 R128.2
NetC131_1: C131.1 C134.2 DZ102.1(K) R127.1 R129.2 U104.1(VCC) U104.5(VCC)
NetC132_1: C132.1 C133.1 R124.1 R125.2 U103.1(VCC) U103.5(VCC)
NetD1_1: D1.1(A) Q23.3(D)
NetD1_3: D1.3(K) R84.2
NetD103_1: D103.1(A) R101.2
NetD117_1: D117.1(A) R109.1
NetD117_2: D117.2(K) Q101.3(D)
NetD118_1: D118.1(A) R114.1
NetD118_2: D118.2(K) Q100.3(D)
NetD121_3: D121.3(K) R127.2
NetD123_2: D123.2(K) D124.2(K) Q27.T(D) Q28.T(D) Q29.T(D) Q30.T(D) Q31.T(D) Q32.T(D) R145.1 R146.2 R147.1
NetD125_2: D125.2(K) Q27.1(G) Q29.1(G) Q31.1(G) R130.1 U103.6(OUT) U103.7(OUT)
NetD126_2: D126.2(K) Q28.1(G) Q30.1(G) Q32.1(G) R86.1 R131.1 R133.1 R134.1
NetDZ3_1: DZ3.1(K) Q9.1(G) R31.1 R33.2
NetDZ6_1: DZ6.1(K) Q18.1(G) R63.1 R64.2
NetDZ101_1: DZ101.1(K) R84.1 R123.2 R133.2 U104.2(IN)
NetQ7_3: Q7.3(D) R19.1
NetQ9_4: Q9.4(D) R31.2 R115.1 R116.2
NetQ10_3: Q10.3(D) R28.1
NetQ14_1: Q14.1(G) R45.1 R50.2
NetQ14_3: Q14.3(D) R52.2 R107.1
NetQ16_3: Q16.3(D) R50.1
NetQ18_3: Q18.3(D) R60.1 R63.2
NetQ23_1: Q23.1(G) R75.1 R77.2
NetQ24_1: Q24.1(G) R79.2 R80.1
NetQ24_3: Q24.3(D) R77.1
NetQ33_1: Q33.1(G) R87.1
NetQ33_3: Q33.3(D) R145.2 R146.1 R147.2
NetQ100_1: Q100.1(G) Q103.3(D) R112.1 R139.2
NetQ101_1: Q101.1(G) Q102.3(D) R135.2 R137.2
NetQ102_1: Q102.1(G) R110.1 R111.1
NetQ103_1: Q103.1(G) R105.1 R113.1
NetR18_1: R18.1 R19.2
NetR25_2: R25.2 U1.6(Dout)
NetR26_2: R26.2 R142.1 U1.3(Cout)
NetR38_1: R38.1 U4.6(B)
NetR42_2: R42.2 U3.6(Dout)
NetR43_2: R43.2 R143.1 U3.3(Cout)
NetR56_2: R56.2 U6.12(P5/HDQ)
NetR70_2: R70.2 U5.6(Dout)
NetR71_2: R71.2 R144.1 U5.3(Cout)
NetR104_2: R104.2 U102.5(WP)
NetR110_2: R110.2 U7.6(Dout) U103.2(IN)
NetR119_2: R119.2 U6.14(P3/SDA)
NetR120_2: R120.2 U6.13(P4/SCL)
NetR121_2: R121.2 TP115.1
NetR122_1: R122.1 TP118.1
NetR125_1: R125.1 U103.3(EN)
NetR129_1: R129.1 U104.3(EN)
NetR130_2: R130.2 TP121.1
NetR131_2: R131.2 TP122.1
NetR134_2: R134.2 U104.6(OUT) U104.7(OUT)
NetR138_2: R138.2 R139.1

Not connected (* = marked no-connect by the designer): P1 9* 10* 18* 19* 28 29 30*; P2 25* 26*; P100 1(CLK) 2(CLK_GND) 3(DATA_GND) 4(DATA) 5(NU) 6(NU) 7(ENABLE_RTN) 8(ENABLE); U1 5(DRAIN)* 14(CB5)*; U3 5(DRAIN)* 14(CB5)*; U4 3(NC); U5 5(DRAIN)* 14(CB5)*; U7 14(CB5)*; U100 4(NC)*; U101 2(NC)* 3(NC)* 4(NC)*

## Layout directives
net class 175V_6: CELLN_OUT
net class 175V_4: NetC50_1
net class 175V_3: NetD123_2, NetQ33_3
net class 175V_5: CELLN_PROT, NetD126_2, NetDZ101_1
net class 175V_1: NetC27_1
net class UL: ALUM_PLATE
net class UL_HALF: AL

## Notes on the sheet
- Cell Status Monitors
- Pack Enabled Indicator
- Data Cable Connector TBD
- Notes:
  1. All Resistors are 5% tolerance unless otherwise specifed.
- Battery Pack Overtemp. Detector
- (near P1) Battery Pack Connector
- (near R103) I2C Battery Temp. Mon.
- (near U101) I2C: 0xDA (W)/0xDB (R)
- EEPROM (1K X 8)
- I2C: 0xA0 (W)/0xA1 (R)
- Battery Charge Monitor
- (near U6) I2C: 0xAA (W)/0xAB (R)
- Discharge Fault
- Pack Enable Switch
- Charge Fault
- Labels drawn without touching a wire or pin: CDRIVE, CELL1N, CELL05P, CELL06P, CELL07P, CELL09P, CELL10P, CELL11P, CELL12P, CELLN_TIE, IN7, VREG